# Altium schematic sheet Extension.SchDoc: Dahlia Carrier Board
size A3; Organization: Toradex AG; Address1: Ebenaustrasse 10; Address2: Horw; Address3: 6048; Address4: Switzerland; DocumentNumber: 18; Revision: V1.1; SheetNumber: 18; SheetTotal: 21; PageSetup: Record=PageOptions|CenterHorizontal=True|CenterVertical=True|PrintScale=0.71|XCorrection=1.00|YCorrection=1.00|PrintKind=1|BorderSize=5000000|LeftOffset=0|BottomOffset=0|Orientation=2|PaperLength=1000|PaperWidth=1000|Scale=100|PaperSource=15|PrintQuality=600|MediaType=1|DitherType=10|PaperKind=A4|PrintScaleMode=1
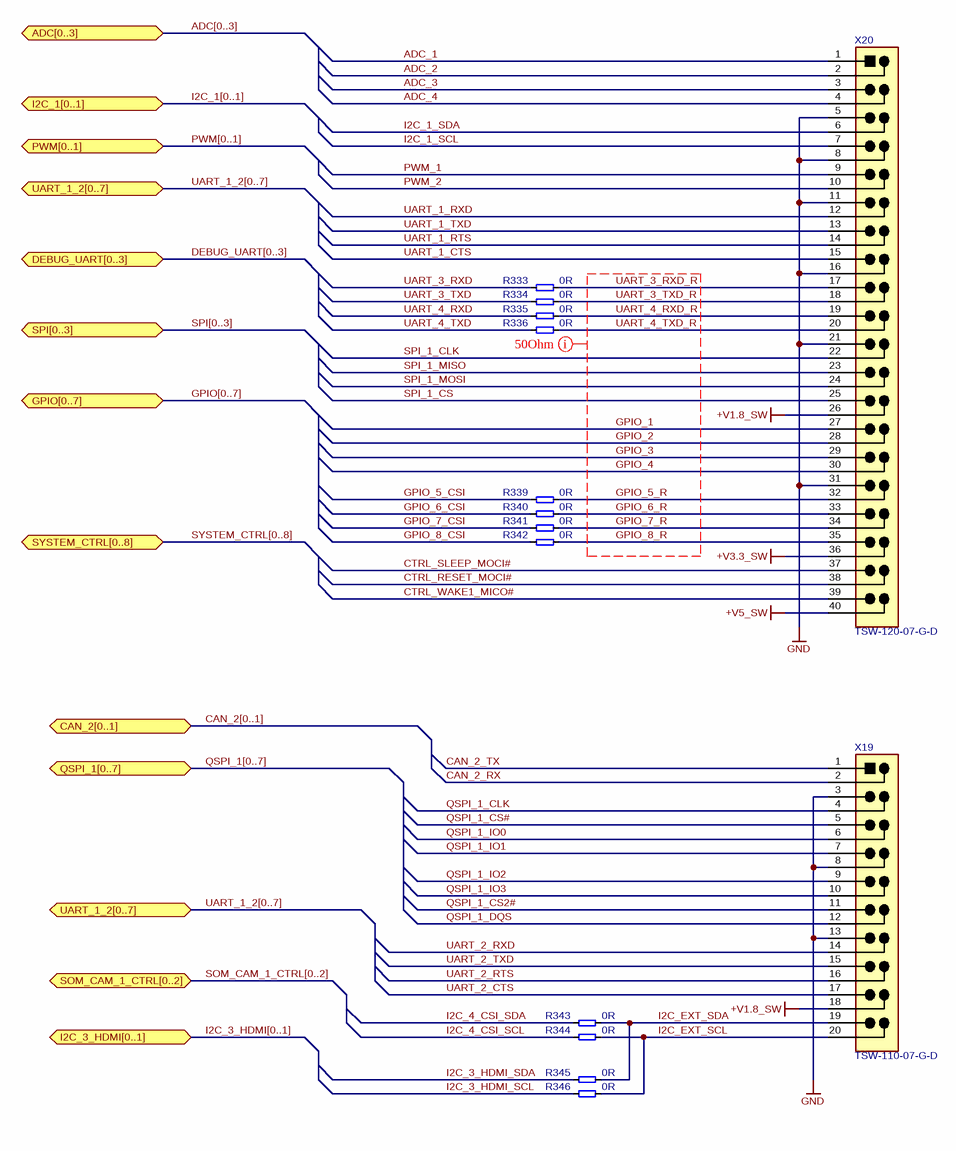
[diagram p0: Extension.SchDoc]

## Parts
R333  0R  [T_RESC0603X30N]
R334  0R  [T_RESC0603X30N]
R335  0R  [T_RESC0603X30N]
R336  0R  [T_RESC0603X30N]
R339  0R  [T_RESC0603X30N]
R340  0R  [T_RESC0603X30N]
R341  0R  [T_RESC0603X30N]
R342  0R  [T_RESC0603X30N]
R343  0R  [T_RESC0603X30N]
R344  0R  [T_RESC0603X30N]
R345  0R  [T_RESC0603X30N]
R346  0R  [T_RESC0603X30N]
X19  TSW-110-07-G-D  [T_Samtec_TSW-110-07-G-D]
X20  TSW-120-07-G-D  [T_Samtec_TSW-120-07-G-D]

## Ports
ADC[0..3] (bidir), CAN_2[0..1] (bidir), DEBUG_UART[0..3] (bidir), GPIO[0..7] (bidir), I2C_1[0..1] (bidir), I2C_3_HDMI[0..1] (bidir), PWM[0..1] (bidir), QSPI_1[0..7] (bidir), SOM_CAM_1_CTRL[0..2] (bidir), SPI[0..3] (bidir), SYSTEM_CTRL[0..8] (bidir), UART_1_2[0..7] (bidir)

## Nets
+V1.8_SW: X19.18 X20.26
+V3.3_SW: X20.36
+V5_SW: X20.40
GND: X19.3 X19.8 X19.13 X20.5 X20.8 X20.11 X20.16 X20.21 X20.31
ADC_1: X20.1
ADC_2: X20.2
ADC_3: X20.3
ADC_4: X20.4
CAN_2_RX: X19.2
CAN_2_TX: X19.1
CTRL_RESET_MOCI#: X20.38
CTRL_SLEEP_MOCI#: X20.37
CTRL_WAKE1_MICO#: X20.39
GPIO_1: X20.27
GPIO_2: X20.28
GPIO_3: X20.29
GPIO_4: X20.30
GPIO_5_CSI: R339.2
GPIO_5_R: R339.1 X20.32
GPIO_6_CSI: R340.2
GPIO_6_R: R340.1 X20.33
GPIO_7_CSI: R341.2
GPIO_7_R: R341.1 X20.34
GPIO_8_CSI: R342.2
GPIO_8_R: R342.1 X20.35
I2C_1_SCL: X20.7
I2C_1_SDA: X20.6
I2C_3_HDMI_SCL: R346.2
I2C_3_HDMI_SDA: R345.2
I2C_4_CSI_SCL: R344.2
I2C_4_CSI_SDA: R343.2
I2C_EXT_SCL: R344.1 R346.1 X19.20
I2C_EXT_SDA: R343.1 R345.1 X19.19
PWM_1: X20.9
PWM_2: X20.10
QSPI_1_CLK: X19.4
QSPI_1_CS2#: X19.11
QSPI_1_CS#: X19.5
QSPI_1_DQS: X19.12
QSPI_1_IO0: X19.6
QSPI_1_IO1: X19.7
QSPI_1_IO2: X19.9
QSPI_1_IO3: X19.10
SPI_1_CLK: X20.22
SPI_1_CS: X20.25
SPI_1_MISO: X20.23
SPI_1_MOSI: X20.24
UART_1_CTS: X20.15
UART_1_RTS: X20.14
UART_1_RXD: X20.12
UART_1_TXD: X20.13
UART_2_CTS: X19.17
UART_2_RTS: X19.16
UART_2_RXD: X19.14
UART_2_TXD: X19.15
UART_3_RXD: R333.2
UART_3_RXD_R: R333.1 X20.17
UART_3_TXD: R334.2
UART_3_TXD_R: R334.1 X20.18
UART_4_RXD: R335.2
UART_4_RXD_R: R335.1 X20.19
UART_4_TXD: R336.2
UART_4_TXD_R: R336.1 X20.20

## Buses and harness runs
bus ADC[0..3] = port ADC[0..3]
bus CAN_2[0..1] = port CAN_2[0..1]
bus DEBUG_UART[0..3] = port DEBUG_UART[0..3]
bus GPIO[0..7] = port GPIO[0..7]
bus I2C_1[0..1] = port I2C_1[0..1]
bus I2C_3_HDMI[0..1] = port I2C_3_HDMI[0..1]
bus PWM[0..1] = port PWM[0..1]
bus QSPI_1[0..7] = port QSPI_1[0..7]
bus SOM_CAM_1_CTRL[0..2] = port SOM_CAM_1_CTRL[0..2]
bus SPI[0..3] = port SPI[0..3]
bus SYSTEM_CTRL[0..8] = port SYSTEM_CTRL[0..8]
bus UART_1_2[0..7] = port UART_1_2[0..7]

## Layout directives
net class 50Ohm: GPIO_1, GPIO_2, GPIO_3, GPIO_4, GPIO_5_R, GPIO_6_R, GPIO_7_R, GPIO_8_R, UART_3_RXD_R, UART_3_TXD_R, UART_4_RXD_R, UART_4_TXD_R

## Notes on the sheet
- Title
- Size:
- Date:
- A3
- Number:
- Time:
- Revision:
- Sheet
- of
- File:

## Library data of the parts
R333-R336 R339-R346 = R-0R-63mW-1%-0603: Resistor 0 ohm 63mW 1% 0603; Rating: 63mW; Tolerance: 1%; Value: 0R
X19 = CON-Samtec-TSW-110-07-G-D: Header 2x10 pin 2.54mm pitch; Manufacturer Name: Samtec; Pitch: 2.54mm; No. of ways: 2x10; Manufacturer Part No.: TSW-110-07-G-D
X20 = CON-Samtec-TSW-120-07-G-D: Header 2x20 pin 2.54mm pitch; Manufacturer Name: Samtec; Pitch: 2.54mm; No. of ways: 2x20; Manufacturer Part No.: TSW-120-07-G-D